# Altium schematic sheet USB Downstream Type C Port 4.SchDoc: DO NOT FILL THIS IN
size Tabloid; Date: DO NOT FILL THIS IN; ApprovedBy: DO NOT FILL THIS IN; CheckedBy: DO NOT FILL THIS IN; Author: DO NOT FILL THIS IN; CompanyName: DO NOT FILL THIS IN; DrawnBy: DO NOT FILL THIS IN; Engineer: DO NOT FILL THIS IN; Organization: DO NOT FILL THIS IN; Address1: DO NOT FILL THIS IN; Address2: DO NOT FILL THIS IN; Address3: DO NOT FILL THIS IN; Address4: DO NOT FILL THIS IN; DocumentNumber: DO NOT FILL THIS IN; Revision: DO NOT FILL THIS IN; SheetNumber: 8; SheetTotal: 9; PageSetup: Record=PageOptions|CenterHorizontal=True|CenterVertical=True|PrintScale=1.00|XCorrection=1.00|YCorrection=1.00|PrintKind=1|BorderSize=5000000|LeftOffset=0|BottomOffset=0|Orientation=2|PaperLength=1000|PaperWidth=1000|Scale=100|PaperSource=7|PrintQuality=-4|MediaType=1|DitherType=10|PaperKind=Ledger|PrintScaleMode=1; cpr-ItemNumber: 025619; cpr-ItemName1: TurtleBot4 UI board; cpr-ItemName2: Rev 2; cpr-Revision: 2; cpr-SheetNumber: 8; cpr-SheetTotal: 9; cpr-Draft: AG; cpr-DraftDate: 19/04/2022; Time: DO NOT FILL THIS IN; ImagePath: DO NOT FILL THIS IN; Application_BuildNumber: DO NOT FILL THIS IN
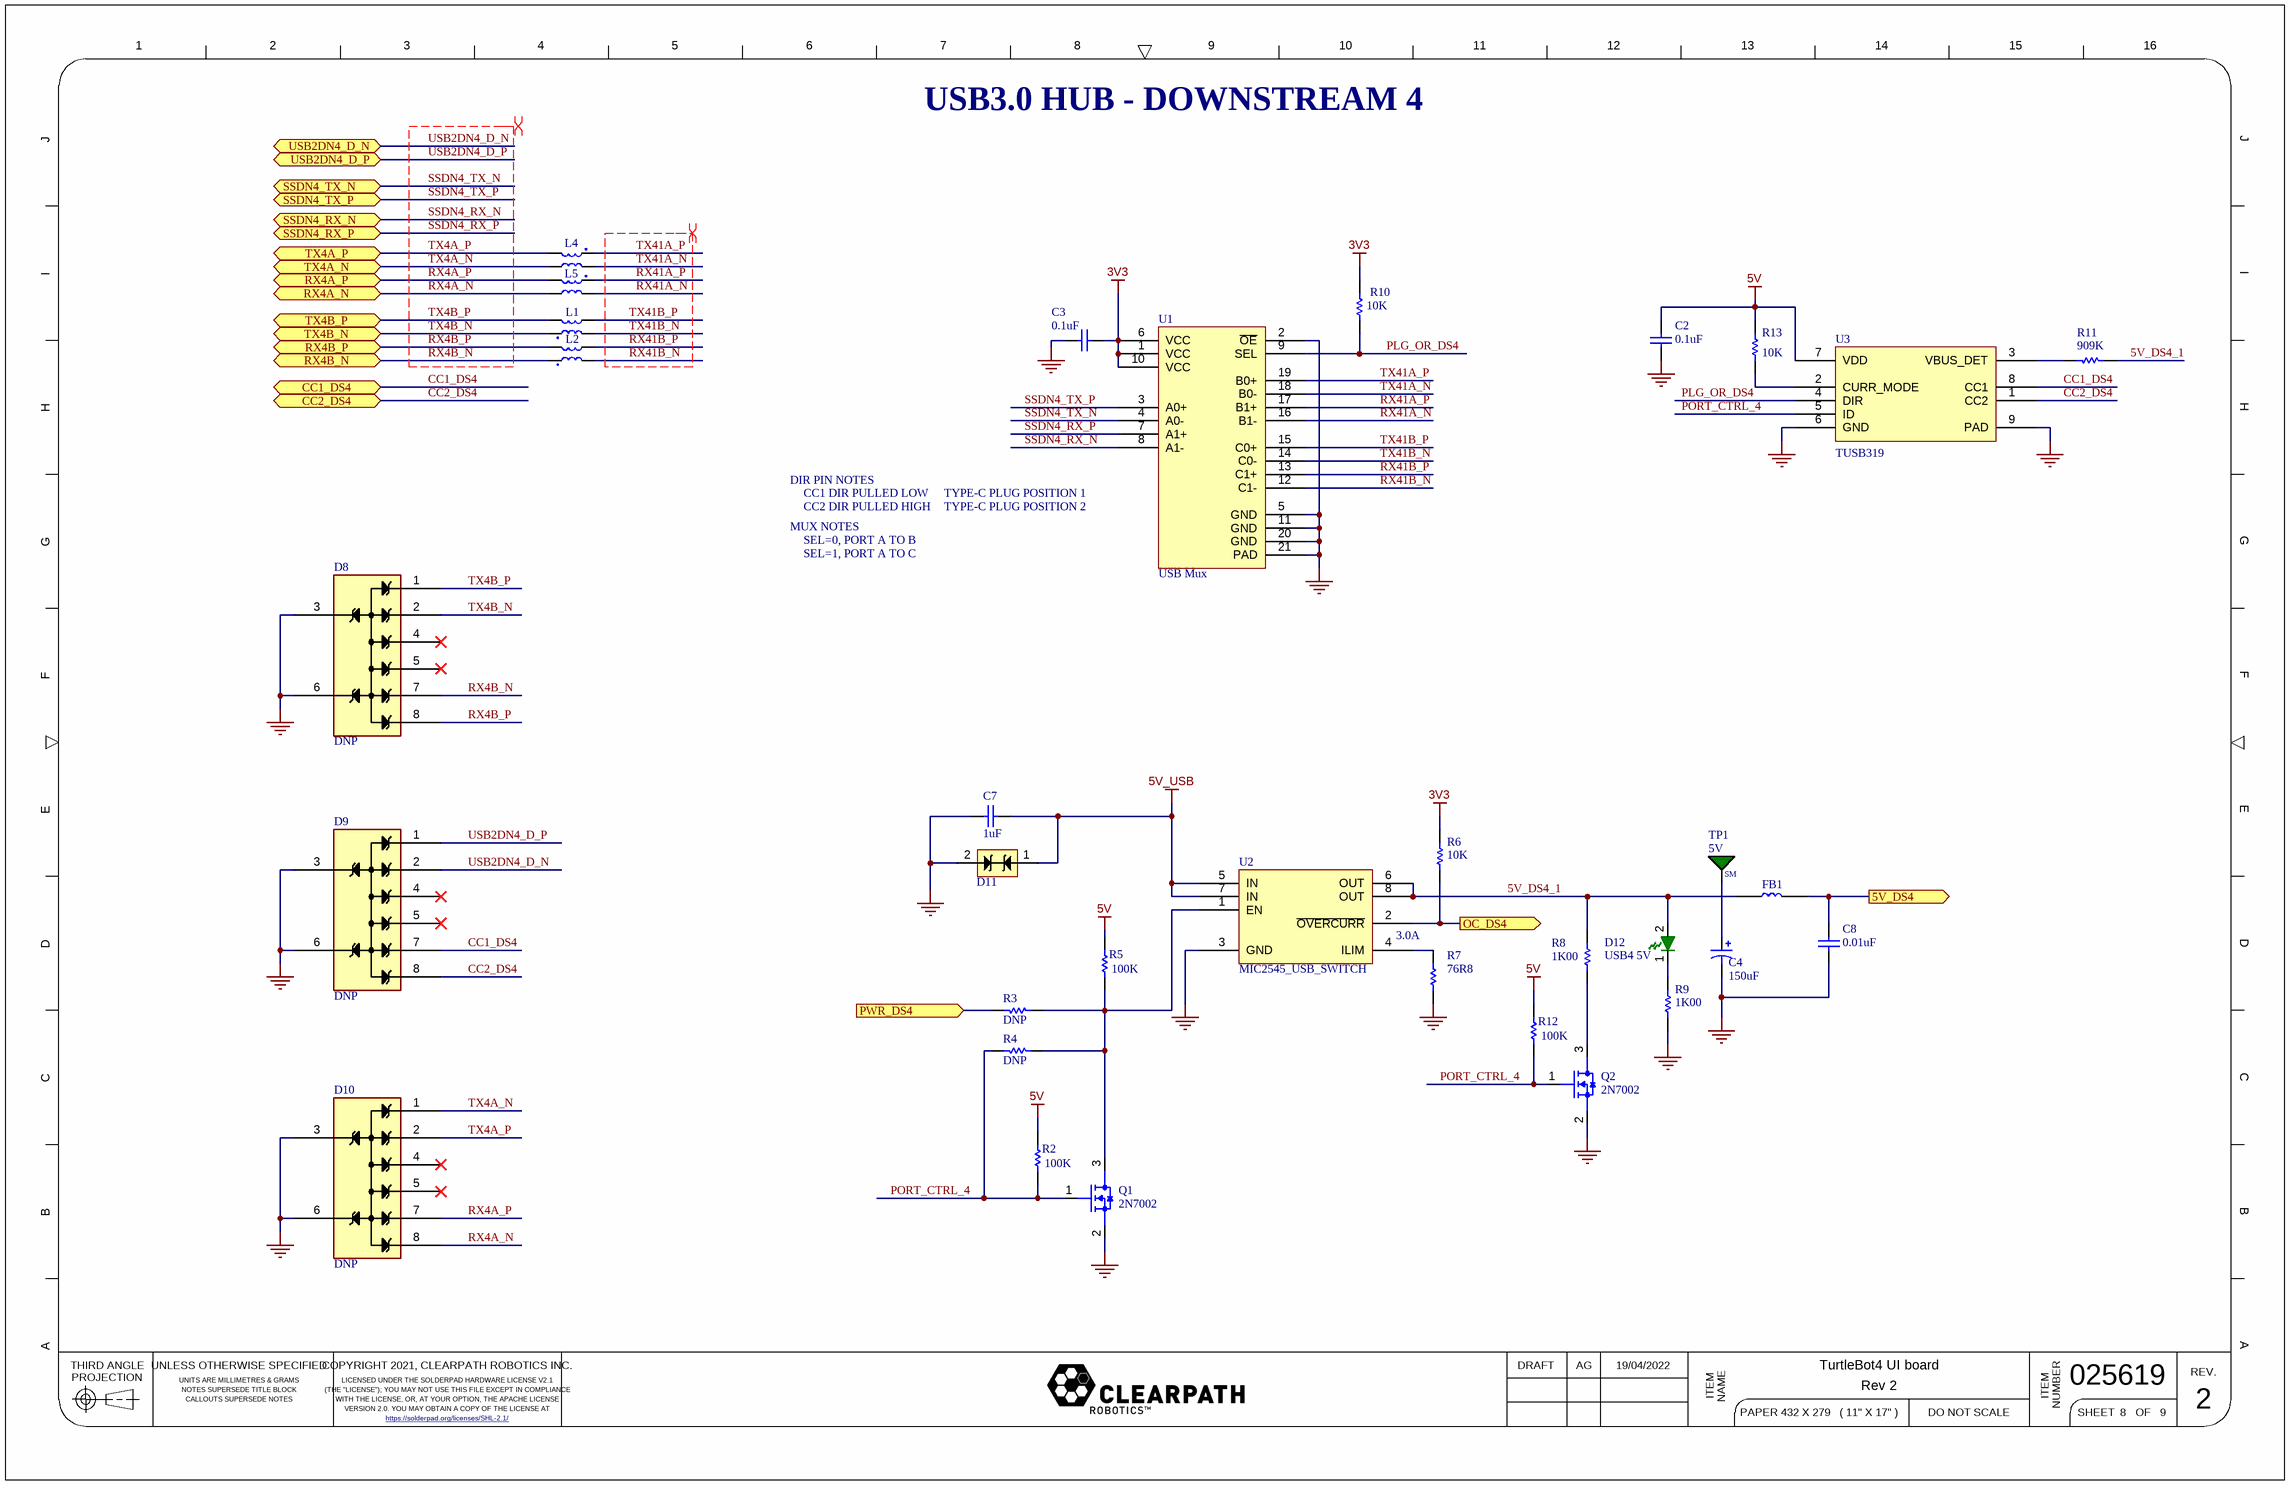
[diagram p0: USB Downstream Type C Port 4.SchDoc]

## Parts
C2  value 0.1uF  [C0805]  (hidden comment: Capacitor _SMT)
C3  value 0.1uF  [C0805]  (hidden comment: Capacitor _SMT)
C4  value 150uF  [CAPMP7.6X4.3_3.1N_KEM-M]  (hidden comment: Cap Tant)
C7  value 1uF  [C0805]  (hidden comment: Capacitor _SMT)
C8  value 0.01uF  [C0805]  (hidden comment: Capacitor _SMT)
D8  DNP  [ESD7016]
D9  DNP  [ESD7016]
D10  DNP  [ESD7016]
D11  TVS DIODE BIDIR 15V SMC  [DO-214AA]  (value not drawn)
D12  USB4 5V  [LED_0805_GRN]
FB1  742792602  [R0603]  (value not drawn)
L1  CMC 100MA 2LN 90 OHM SMD2  [cmc_90_ohms]  (value not drawn)
L2  CMC 100MA 2LN 90 OHM SMD2  [cmc_90_ohms]  (value not drawn)
L4  CMC 100MA 2LN 90 OHM SMD2  [cmc_90_ohms]  (value not drawn)
L5  CMC 100MA 2LN 90 OHM SMD2  [cmc_90_ohms]  (value not drawn)
Q1  Mfg PN: 2N7002  [SOT-23-3]  (hidden comment: NFET)
Q2  Mfg PN: 2N7002  [SOT-23-3]  (hidden comment: NFET)
R2  value 100K  [R0805]  (hidden comment: Resistor_SMT)
R3  value DNP  [R0805]  (hidden comment: Resistor_SMT)
R4  value DNP  [R0805]  (hidden comment: Resistor_SMT)
R5  value 100K  [R0805]  (hidden comment: Resistor_SMT)
R6  value 10K  [R0805]  (hidden comment: Resistor_SMT)
R7  3.0A  value 76R8  [R0805]
R8  value 1K00  [R0805]  (hidden comment: Resistor_SMT)
R9  value 1K00  [R0805]  (hidden comment: Resistor_SMT)
R10  value 10K  [R0805]  (hidden comment: Resistor_SMT)
R11  value 909K  [R0805]  (hidden comment: Resistor_SMT)
R12  value 100K  [R0805]  (hidden comment: Resistor_SMT)
R13  value 10K  [R0805]  (hidden comment: Resistor_SMT)
TP1  5V  [TP_28SM]
U1  USB Mux  [TQFN20]
U2  MIC2545_USB_SWITCH  [SOIC-8-150]
U3  TUSB319  [WSON8]

## Ports
5V_DS4 (out), CC1_DS4 (bidir), CC2_DS4 (bidir), OC_DS4 (out), PWR_DS4 (in), RX4A_N (bidir), RX4A_P (bidir), RX4B_N (bidir), RX4B_P (bidir), SSDN4_RX_N (bidir), SSDN4_RX_P (bidir), SSDN4_TX_N (bidir), SSDN4_TX_P (bidir), TX4A_N (bidir), TX4A_P (bidir), TX4B_N (bidir), TX4B_P (bidir), USB2DN4_D_N (bidir), USB2DN4_D_P (bidir)

## Nets
3V3: C3.1 R6.1 R10.1 U1.1(VCC) U1.6(VCC) U1.10(VCC)
5V: C2.1 R2.2 R5.2 R12.2 R13.1 U3.7(VDD)
5V_USB: C7.2 D11.1 U2.5(IN) U2.7(IN)
GND: C2.2 C3.2 C4.2 C7.1 C8.2 D8.3 D8.6 D9.3 D9.6 D10.3 D10.6 D11.2 Q1.2(D1) Q2.2(D1) R7.1 R9.2 U1.2(~{OE}) U1.5(GND) U1.11(GND) U1.20(GND) U1.21(PAD) U2.3(GND) U3.6(GND) U3.9(PAD)
5V_DS4: C8.1 FB1.2 ; port 5V_DS4
5V_DS4_1: D12.2(RA) FB1.1 R8.1 R11.2 U2.6(OUT) U2.8(OUT)
CC1_DS4: D9.7 U3.8(CC1) ; port CC1_DS4
CC2_DS4: D9.8 U3.1(CC2) ; port CC2_DS4
OC_DS4: R6.2 U2.2(~{OVERCURR}) ; port OC_DS4
PLG_OR_DS4: R10.2 U1.9(SEL) U3.4(DIR)
PORT_CTRL_4: Q1.1(G1) Q2.1(G1) R2.1 R4.1 R12.1 U3.5(ID)
PWR_DS4: R3.1 ; port PWR_DS4
RX4A_N: D10.8 L5.3 ; port RX4A_N
RX4A_P: D10.7 L5.4 ; port RX4A_P
RX4B_N: D8.7 L2.1 ; port RX4B_N
RX4B_P: D8.8 L2.2 ; port RX4B_P
RX41A_N: L5.2 U1.16(B1-)
RX41A_P: L5.1 U1.17(B1+)
RX41B_N: L2.4 U1.12(C1-)
RX41B_P: L2.3 U1.13(C1+)
SSDN4_RX_N: U1.8(A1-) ; port SSDN4_RX_N
SSDN4_RX_P: U1.7(A1+) ; port SSDN4_RX_P
SSDN4_TX_N: U1.4(A0-) ; port SSDN4_TX_N
SSDN4_TX_P: U1.3(A0+) ; port SSDN4_TX_P
TX4A_N: D10.1 L4.3 ; port TX4A_N
TX4A_P: D10.2 L4.4 ; port TX4A_P
TX4B_N: D8.2 L1.1 ; port TX4B_N
TX4B_P: D8.1 L1.2 ; port TX4B_P
TX41A_N: L4.2 U1.18(B0-)
TX41A_P: L4.1 U1.19(B0+)
TX41B_N: L1.4 U1.14(C0-)
TX41B_P: L1.3 U1.15(C0+)
USB2DN4_D_N: D9.2 ; port USB2DN4_D_N
USB2DN4_D_P: D9.1 ; port USB2DN4_D_P
NetC4_1: C4.1 TP1.1
NetD12_1: D12.1(RK) R9.1
NetQ1_3: Q1.3(S1) R3.2 R4.2 R5.1 U2.1(EN)
NetQ2_3: Q2.3(S1) R8.2
NetR7_2: R7.2 U2.4(ILIM)
NetR11_1: R11.1 U3.3(VBUS_DET)
NetR13_2: R13.2 U3.2(CURR_MODE)

Not connected (* = marked no-connect by the designer): D8 4* 5*; D9 4* 5*; D10 4* 5*

## Layout directives
differential pair; net class USB3; differential pair class DIFF90; rule Matched Net Lengths [Tolerance = 15mil]: RX4A_N, RX4A_P, RX4B_N, RX4B_P, RX41A_N, RX41A_P, RX41B_N, RX41B_P, SSDN4_RX_N, SSDN4_RX_P, SSDN4_TX_N, SSDN4_TX_P, TX4A_N, TX4A_P, TX4B_N, TX4B_P, TX41A_N, TX41A_P, TX41B_N, TX41B_P, USB2DN4_D_N, USB2DN4_D_P

## Notes on the sheet
- USB3.0 HUB - DOWNSTREAM 4
- DIR PIN NOTES
- CC1 DIR PULLED LOW
- TYPE-C PLUG POSITION 1
- MUX NOTES
- CC2 DIR PULLED HIGH
- SEL=0, PORT A TO B
- SEL=1, PORT A TO C
- TYPE-C PLUG POSITION 2
- 1
- 2
- 3
- 4
- 5
- 6
- 7
- 8
- 9
- 10
- 11
- 12
- 13
- 14
- 15
- 16
- J
- I
- H
- G
- F
- E
- D
- C
- B
- A
- THIRD ANGLE
- PROJECTION
- UNLESS OTHERWISE SPECIFIED
- COPYRIGHT 2021, CLEARPATH ROBOTICS INC.
- DRAFT
- REV.
- UNITS ARE MILLIMETRES & GRAMS
- NOTES SUPERSEDE TITLE BLOCK
- CALLOUTS SUPERSEDE NOTES
- LICENSED UNDER THE SOLDERPAD HARDWARE LICENSE V2.1
- (THE "LICENSE"); YOU MAY NOT USE THIS FILE EXCEPT IN COMPLIANCE
- WITH THE LICENSE, OR, AT YOUR OPTION, THE APACHE LICENSE
- VERSION 2.0. YOU MAY OBTAIN A COPY OF THE LICENSE AT
- https://solderpad.org/licenses/SHL-2.1/ <https://solderpad.https://solderpad.org/licenses/SHL-2.1/org/licenses/SHL-2.1/>
- ITEM
- NAME
- PAPER 432 X 279   ( 11" X 17" )
- DO NOT SCALE
- NUMBER
- SHEET
- OF
- (in symbol TP_28SM) SM

## Library data of the parts
C2 C3 = Capacitor _SMT: Capacitor; Tolerance: 10%; Voltage: 50V; Vendor: Digikey; Vendor PN: 311-1140-1-ND; Mfg: Yageo; Mfg PN: CC0805KRX7R9BB104; DNP: *; Package: 0805
C4 = Cap Pol1: CAP TANT 150UF 10% 16V 2917; Vendor: Digikey; Mfg PN: 293D157X9016D2TE3; Vendor PN: 718-1746-1-ND; Mfg: Vishay Sprague; Voltage: 16V; Tolerance: 10%; Package: 2917; Supplier 1: Digi-Key; Supplier Part Number 1: 718-1746-1-ND
C7 = Capacitor _SMT: Capacitor; Tolerance: -20 +80; Voltage: 50V; Vendor: Digikey; Vendor PN: 311-1909-1-ND; Mfg: Yageo; Mfg PN: CC0805ZKY5V9BB105; DNP: *; Package: 0805
C8 = Capacitor _SMT: Capacitor; Tolerance: 10%; Voltage: 50V; Vendor: Digikey; Vendor PN: 1276-CL10B103KB8WPNDCT-ND; Mfg: Samsung Electro-Mechanics; Mfg PN: CL10B103KB8WPND; DNP: *; Package: 0603; Supplier 1: Digi-Key; Supplier Part Number 1: 1276-CL10B103KB8WPNDCT-ND
D8-D10 = ESD7016: USB3 TVS diode assy; Vendor 1: Digikey; Vendor 1 PN: ESD7016MUTAGOSCT-ND; Mfg: ON Semi; Mfg PN: ESD7016MUTAG; Vendor 2 PN: *; Vendor 2: *
D11 = TVS DIODE BIDIR 15V SMC: TVS 600W 15V BI-DIR DO-214AA; Vendor: Digikey; Vendor PN: 18-SMA6J5.0CACT-ND; Mfg: Littelfuse Inc.; Mfg PN: SMA6J5.0CA; Package: DO214AC; Supplier 1: Digi-Key; Supplier Part Number 1: 18-SMA6J5.0CACT-ND
D12 = GREEN_LED: Green LED; Vendor: Digikey; Mfg PN: LTST-C170KGKT; Mfg: LiteOn; Vendor 1: 160-1414-1-ND; Package: 0805
FB1 = 742792602: 60 Ohms 1 Signal Line Ferrite Bead 0603 (1608 Metric) 3A 40mOhm; Supplier 1: Digi-Key; Supplier Part Number 1: 732-4660-1-ND
L1 L2 L4 L5 = CMC 90_Ohms: Line Common Mode Choke Surface Mount 90 Ohms 100mA DCR 5Ohm; Supplier 1: Digi-Key; Supplier Part Number 1: 490-16595-1-ND
Q1 Q2 = NFET_SNGL: Vendor: Digikey; Vendor PN: 2N7002NCT-ND; Mfg: ON Semi; Package: SOT23-3
R2 R5 R12 = Resistor_SMT: Resistor; Vendor: Digikey; Vendor PN: 311-100KCRCT-ND; Tolerance: 1%; Mfg: Yageo; Mfg PN: RC0805FR-07100KL; Power Rating: *; Package: 0805
R3 R4 = Resistor_SMT: Resistor; Vendor: Digikey; Vendor PN: 311-0.0ARCT-ND; Mfg: Yageo; Mfg PN: RC0805JR-070RL; Power Rating: *; Package: 0805
R6 R10 R13 = Resistor_SMT: Resistor; Vendor: Digikey; Vendor PN: 311-10.0KCRCT-ND; Tolerance: 1%; Mfg: Yageo; Mfg PN: RC0805FR-0710KL; Power Rating: *; Package: 0805
  R6: Supplier 1: Digi-Key; Supplier Part Number 1: 311-10.0KCRTR-ND
R7 = Resistor_SMT: Resistor; Vendor: Digikey; Vendor PN: 311-76.8CRCT-ND; Tolerance: 1%; Mfg: Yageo; Mfg PN: RC0805FR-0776R8L; Power Rating: *; Package: 0805
R8 R9 = Resistor_SMT: Resistor; Vendor: Digikey; Vendor PN: 311-1.00KCRCT-ND; Tolerance: 1%; Mfg: Yageo; Mfg PN: RC0805FR-071KL; Power Rating: *; Package: 0805
R11 = Resistor_SMT: Resistor; Vendor: Digikey; Vendor PN: 311-909KCRCT-ND; Tolerance: 1%; Mfg: Yageo; Mfg PN: RC0805FR-07909KL; Power Rating: *; Package: 0805
TP1 = TP_28SM: Test point, 28 Mil exposed pad; Manufacturer: Clearpath Robotics Inc.; ID: 1; PCB Component: TP_28SM; Status: Draft; Vendor: Clearpath Robotics Inc.; Vendor PN: TP_28SM; Type: SM Pad; Features: Exposed 28mil pad; Octopart Link: N/A
U1 = TC7PCI3212: TC7PCI3212MT,LF USB3.0 Mux; Manufacturer: Toshiba; Vendor 1 PN: 757-TC7PCI3212MTLF; Vendor 1: Mouser; Package: TQFN-20; Mfg PN: TC7PCI3212MT,LF
U2 = MIC2545_USB_SWITCH: IC PWR SWITCH N-CHAN 1:1 8SOIC; Vendor PN: MIC2545A-1YM-CT-ND; Vendor: Digikey; Mfg PN: MIC2545A-1YM-TR; Mfg: Microchip; Package: SOIC8
U3 = TUSB319: USB Type C Controller; Vendor 1 PN: 595-TUSB319IDRFRQ1; Vendor 1: Mouser; Mfg PN: TUSB319IDRFRQ1; Mfg: Texas Instruments; Package: WSON8